# Altium project Laser_Module_Adapter_PCB.PrjPCB
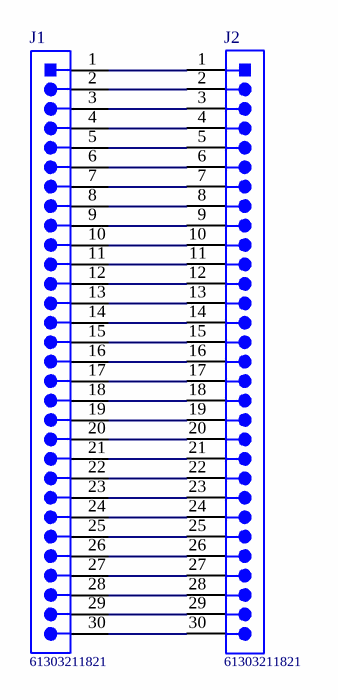
[diagram p0: Laser_Module_Adapter_PCB.SchDoc]
1 sheet, 2 parts. Net scope: hierarchical (ports join the sheet entries above them; power ports are global).
Board file: Laser_Module_Adapter_PCB.PCBDOC

## Sheet Laser_Module_Adapter_PCB.SchDoc: Goldpin
size 420 x 297 mm; CheckedBy: MK; Author: G.K.; CompanyName: CREOTECH; DrawnBy: G.K.; Organization: CTI SA; Address1: Creotech Instruments SA; Address2: Okulickiego 7/9, 05-500 Poland; Revision: -; SheetNumber: -; SheetTotal: -; ModifiedBy: -; CreateDate: XX/XX/XXXX; CheckedDate: -; Title2: Jumper; DivGrp: CTI; Designer: G.K.; ModifiedDate: -; ProjectName: FMC DAC 100M 14B 16CHA ADC 2M 14B 4CHA

### Parts
J1  61303211821  [61303211821_30]
J2  61303211821  [61303211821_30]

### Nets
NetJ1_1: J1.1 J2.1
NetJ1_2: J1.2 J2.2
NetJ1_3: J1.3 J2.3
NetJ1_4: J1.4 J2.4
NetJ1_5: J1.5 J2.5
NetJ1_6: J1.6 J2.6
NetJ1_7: J1.7 J2.7
NetJ1_8: J1.8 J2.8
NetJ1_9: J1.9 J2.9
NetJ1_10: J1.10 J2.10
NetJ1_11: J1.11 J2.11
NetJ1_12: J1.12 J2.12
NetJ1_13: J1.13 J2.13
NetJ1_14: J1.14 J2.14
NetJ1_15: J1.15 J2.15
NetJ1_16: J1.16 J2.16
NetJ1_17: J1.17 J2.17
NetJ1_18: J1.18 J2.18
NetJ1_19: J1.19 J2.19
NetJ1_20: J1.20 J2.20
NetJ1_21: J1.21 J2.21
NetJ1_22: J1.22 J2.22
NetJ1_23: J1.23 J2.23
NetJ1_24: J1.24 J2.24
NetJ1_25: J1.25 J2.25
NetJ1_26: J1.26 J2.26
NetJ1_27: J1.27 J2.27
NetJ1_28: J1.28 J2.28
NetJ1_29: J1.29 J2.29
NetJ1_30: J1.30 J2.30

### Notes on the sheet
- Project/Equipment
- Document
- Designer
- Drawn by
- Check.by
- Copyright Creotech Instruments SA 2014.
  This documentation describes Open Hardware and is licensed under the CERN OHL v.1.1. You may redistribute and modify this documentation under the terms of the CERN OHL v.1.1. (http://ohwr.org/CERNOHL). This documentation is distributed WITHOUT ANY EXPRESS OR IMPLIED WARRANTY, INCLUDING OF MERCHANTABILITY, SATISFACTORY QUALITY AND FITNESS FOR A PARTICULAR PURPOSE. Please see the CERN OHL v.1.1 for applicable conditions.
- File
- Last Mod.
- Print Date
- Sheet
- Size
- A3
- of
- Rev

### Library data of the parts
J1 J2 = CON_1x30_2.54_61303211821: WR-PHD socket Header, THT, pitch 2.54mm, Single Row, Angled, 32p; Manufacturer: Wurth Elektronik; Pin Number: 32; Gender: Pin Header; Rated Current: 3A; Working Voltage: 250VAC; Withstanding Voltage: 500VAC; Contact Resistance: 20mOhm; ComponentLink1Description: Manufacturer; ComponentLink1URL: http://www.we-online.de; ComponentLink2Description: Datasheet; ComponentLink2URL: https://www.we-online.com/catalog/datasheet/61303211021.pdf; Manufacturer Part Number: 61303211821; Pitch: 2.54mm; Operating Temperature: -40 to +105degC; Mounting Technology: THT; Packaging: Bag; Row Number: Single; Orientation: Angled